# Altium project ZP2_SMT.PrjPcb
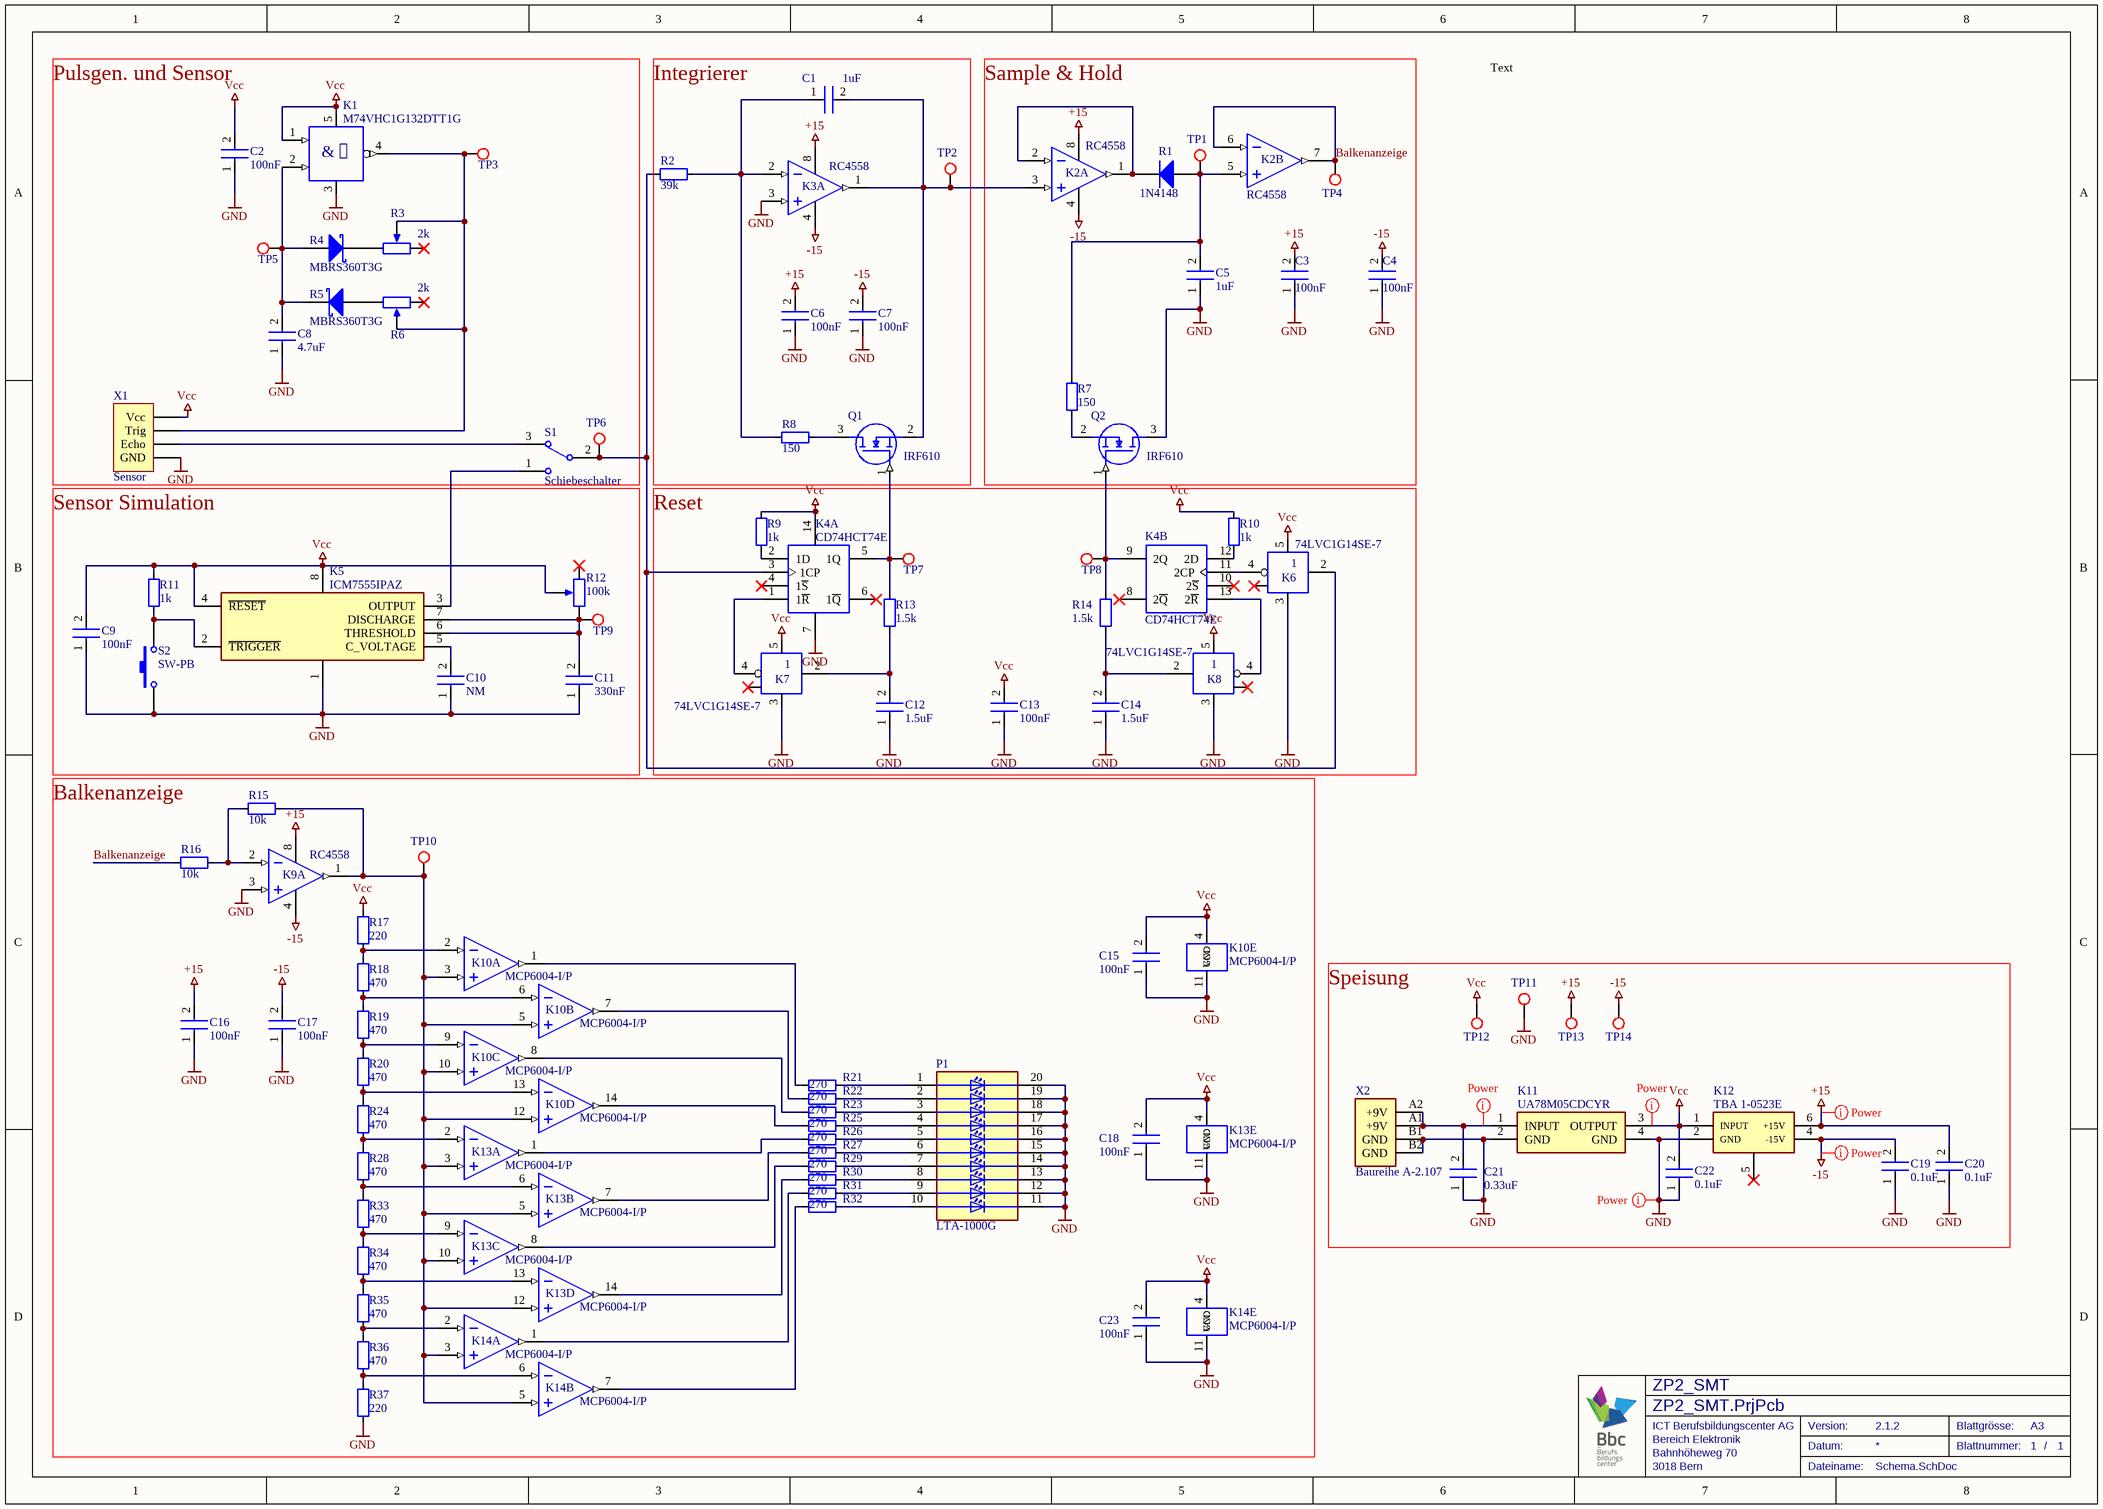
[diagram p0: Schema.SchDoc]
1 sheet, 95 parts. Net scope: global (net labels, ports and power ports of the same name join across sheets).
Board file: PCB.PcbDoc

## Sheet Schema.SchDoc: ZP2_SMT
size A3; Date: 18.08.2020; Author: bweina; CompanyName: ICT Bbc AG; DrawnBy: bweina; DocumentNumber: 1; Revision: 2.1.2; SheetNumber: 1; SheetTotal: 1

### Parts
C1  1uF  [okCAP CER 1206 H]
C2  100nF  [okCAP CER 1206 H]
C3  100nF  [okCAP CER 1206 H]
C4  100nF  [okCAP CER 1206 H]
C5  1uF  [okCAP CER 1206 H]
C6  100nF  [okCAP CER 1206 H]
C7  100nF  [okCAP CER 1206 H]
C8  4.7uF  [okCAP CER 1206 H]
C9  100nF  [okCAP CER 1206 H]
C10  NM  [okCAP CER 1206 H]
C11  330nF  [okCAP CER 1206 H]
C12  1.5uF  [okCAP CER 1206 H]
C13  100nF  [okCAP CER 1206 H]
C14  1.5uF  [okCAP CER 1206 H]
C15  100nF  [okCAP CER 1206 H]
C16  100nF  [okCAP CER 1206 H]
C17  100nF  [okCAP CER 1206 H]
C18  100nF  [okCAP CER 1206 H]
C19  0.1uF  [okCAP CER 1206 H]
C20  0.1uF  [okCAP CER 1206 H]
C21  0.33uF  [okCAP CER 1206 H]
C22  0.1uF  [okCAP CER 1206 H]
C23  100nF  [okCAP CER 1206 H]
K1  M74VHC1G132DTT1G  [okTSOP-5]
K2  RC4558  [okDIP8-300]  (parts A,B of 2)
K3  RC4558  [okDIP8-300]  (part A of 2)
K4  CD74HCT74E  [okDIP14-300]  (parts A,B of 2)
K5  ICM7555IPAZ  [okDIP8-300]
K6  74LVC1G14SE-7  [okSOT23-5]
K7  74LVC1G14SE-7  [okSOT23-5]
K8  74LVC1G14SE-7  [okSOT23-5]
K9  RC4558  [okDIP8-300]  (part A of 2)
K10  MCP6004-I/P  [okDIP14-300]  (parts A,B,C,D,E of 5)
K11  UA78M05CDCYR  [okSOT23-UA78M05]
K12  TBA 1-0523E  [okTBA 1-0523E]
K13  MCP6004-I/P  [okDIP14-300]  (parts A,B,C,D,E of 5)
K14  MCP6004-I/P  [okDIP14-300]  (parts A,B,E of 5)
P1  LTA-1000G  [okDIP20]
Q1  IRF610  [okTO-220-1]
Q2  IRF610  [okTO-220-1]
R1  1N4148  [okDiode 10mm]
R2  value 39k  [okRES 10mm]  (hidden comment: Resistor)
R3  value 2k  [ok3362P]  (hidden comment: RPot)
R4  MBRS360T3G  [okDiode DO-214AA SMB H]
R5  MBRS360T3G  [okDiode DO-214AA SMB H]
R6  value 2k  [ok3362P]  (hidden comment: RPot)
R7  value 150  [okRES 10mm]  (hidden comment: Resistor)
R8  value 150  [okRES 10mm]  (hidden comment: Resistor)
R9  value 1k  [okRES 10mm]  (hidden comment: Resistor)
R10  value 1k  [okRES 10mm]  (hidden comment: Resistor)
R11  value 1k  [okRES 10mm]  (hidden comment: Resistor)
R12  value 100k  [ok3386F]  (hidden comment: RPot)
R13  value 1.5k  [okRES 10mm]  (hidden comment: Resistor)
R14  value 1.5k  [okRES 10mm]  (hidden comment: Resistor)
R15  value 10k  [okRES 10mm]  (hidden comment: Resistor)
R16  value 10k  [okRES 10mm]  (hidden comment: Resistor)
R17  value 220  [okRES 10mm]  (hidden comment: Resistor)
R18  value 470  [okRES 10mm]  (hidden comment: Resistor)
R19  value 470  [okRES 10mm]  (hidden comment: Resistor)
R20  value 470  [okRES 10mm]  (hidden comment: Resistor)
R21  value 270  [okRES 10mm]  (hidden comment: Resistor)
R22  value 270  [okRES 10mm]  (hidden comment: Resistor)
R23  value 270  [okRES 10mm]  (hidden comment: Resistor)
R24  value 470  [okRES 10mm]  (hidden comment: Resistor)
R25  value 270  [okRES 10mm]  (hidden comment: Resistor)
R26  value 270  [okRES 10mm]  (hidden comment: Resistor)
R27  value 270  [okRES 10mm]  (hidden comment: Resistor)
R28  value 470  [okRES 10mm]  (hidden comment: Resistor)
R29  value 270  [okRES 10mm]  (hidden comment: Resistor)
R30  value 270  [okRES 10mm]  (hidden comment: Resistor)
R31  value 270  [okRES 10mm]  (hidden comment: Resistor)
R32  value 270  [okRES 10mm]  (hidden comment: Resistor)
R33  value 470  [okRES 10mm]  (hidden comment: Resistor)
R34  value 470  [okRES 10mm]  (hidden comment: Resistor)
R35  value 470  [okRES 10mm]  (hidden comment: Resistor)
R36  value 470  [okRES 10mm]  (hidden comment: Resistor)
R37  value 220  [okRES 10mm]  (hidden comment: Resistor)
S1  Schiebeschalter  [okSCHIEBESCHALTER]
S2  SW-PB  [okdrucktaster]
TP1  Lötstützpunkt  [okLötstützpunkt]  (value not drawn)
TP2  Lötstützpunkt  [okLötstützpunkt]  (value not drawn)
TP3  Lötstützpunkt  [okLötstützpunkt]  (value not drawn)
TP4  Lötstützpunkt  [okLötstützpunkt]  (value not drawn)
TP5  Lötstützpunkt  [okLötstützpunkt]  (value not drawn)
TP6  Lötstützpunkt  [okLötstützpunkt]  (value not drawn)
TP7  Lötstützpunkt  [okLötstützpunkt]  (value not drawn)
TP8  Lötstützpunkt  [okLötstützpunkt]  (value not drawn)
TP9  Lötstützpunkt  [okLötstützpunkt]  (value not drawn)
TP10  Lötstützpunkt  [okLötstützpunkt]  (value not drawn)
TP11  Lötstützpunkt  [okLötstützpunkt]  (value not drawn)
TP12  Lötstützpunkt  [okLötstützpunkt]  (value not drawn)
TP13  Lötstützpunkt  [okLötstützpunkt]  (value not drawn)
TP14  Lötstützpunkt  [okLötstützpunkt]  (value not drawn)
X1  Sensor  [okHeader Female 4pin]
X2  Baureihe A-2.107  [ok24.243.X]

### Nets
+15: C3.2 C6.2 C16.2 C20.2 K2.8(V+) K3.8(V+) K9.8(V+) K12.6(+15V) TP13.1
-15: C4.2 C7.2 C17.2 C19.2 K2.4(V-) K3.4(V-) K9.4(V-) K12.4(-15V) TP14.1
GND: C2.1 C3.1 C4.1 C5.1 C6.1 C7.1 C8.1 C9.1 C10.1 C11.1 C12.1 C13.1 C14.1 C15.1 C16.1 C17.1 C18.1 C19.1 C20.1 C21.1 C22.1 C23.1 K1.3(GND) K3.3(IN1+) K4.7(GND) K5.1(GND) K6.3(GND) K7.3(GND) K8.3(GND) K9.3(IN1+) K10.11(GND) K11.2(GND) K11.4(GND) K12.2(GND) K13.11(GND) K14.11(GND) P1.11(CATHODE_K) P1.12(CATHODE_J) P1.13(CATHODE_H) P1.14(CATHODE_G) P1.15(CATHODE_F) P1.16(CATHODE_E) P1.17(CATHODE_D) P1.18(CATHODE_C) P1.19(CATHODE_B) P1.20(CATHODE_A) Q2.3(D) R37.1 S2.4 TP11.1 X1.4(GND) X2.B1(GND) X2.B2(GND)
Vcc: C2.2 C9.2 C13.2 C15.2 C18.2 C22.2 C23.2 K1.1(A) K1.5(VCC) K4.14(VCC) K5.4(~{RESET}) K5.8(VDD) K6.5(Vcc) K7.5(Vcc) K8.5(Vcc) K10.4(VCC) K11.3(OUTPUT) K12.1(INPUT) K13.4(VCC) K14.4(VCC) R9.2 R10.2 R11.2 R12.2(TAP) R17.2 TP12.1 X1.1(Vcc)
Balkenanzeige: K2.6(IN2-) K2.7(OUT2) R16.1 TP4.1
NetC1_1: C1.1 K3.2(IN1-) R2.2 R8.1
NetC1_2: C1.2 K2.3(IN1+) K3.1(OUT1) Q1.2(S) TP2.1
NetC5_2: C5.2 K2.5(IN2+) R1.A(Anode) R7.2 TP1.1
NetC8_2: C8.2 K1.2(B) R4.3(A) R5.1(K) TP5.1
NetC10_2: C10.2 K5.5(C_VOLTAGE)
NetC11_2: C11.2 K5.6(THRESHOLD) K5.7(DISCHARGE) R12.1(BOT) TP9.1
NetC12_2: C12.2 K7.2(A) R13.1
NetC14_2: C14.2 K8.2(A) R14.2
NetC21_2: C21.2 K11.1(INPUT) X2.A1(+9V) X2.A2(+9V)
NetK1_4: K1.4(~{Y}) R3.2(TAP) R6.2(TAP) TP3.1 X1.2(Trig)
NetK2_1: K2.1(OUT1) K2.2(IN1-) R1.C(Cathode)
NetK4_1: K4.1(1~{R}) K7.4(Y)
NetK4_2: K4.2(1D) R9.1
NetK4_3: K4.3(1CP) K6.2(A) R2.1 S1.2 TP6.1
NetK4_5: K4.5(1Q) Q1.1(G) R13.2 TP7.1
NetK4_9: K4.9(2Q) Q2.1(G) R14.1 TP8.1
NetK4_11: K4.11(2CP) K6.4(Y)
NetK4_12: K4.12(2D) R10.1
NetK4_13: K4.13(2~{R}) K8.4(Y)
NetK5_2: K5.2(~{TRIGGER}) R11.1 S2.1
NetK5_3: K5.3(OUTPUT) S1.1
NetK9_1: K9.1(OUT1) K10.3(VINA+) K10.5(VINB+) K10.10(VINC+) K10.12(VIND+) K13.3(VINA+) K13.5(VINB+) K13.10(VINC+) K13.12(VIND+) K14.3(VINA+) K14.5(VINB+) R15.2 TP10.1
NetK9_2: K9.2(IN1-) R15.1 R16.2
NetK10_1: K10.1(VOUTA) R21.1
NetK10_2: K10.2(VINA-) R17.1 R18.2
NetK10_6: K10.6(VINB-) R18.1 R19.2
NetK10_7: K10.7(VOUTB) R22.1
NetK10_8: K10.8(VOUTC) R23.1
NetK10_9: K10.9(VINC-) R19.1 R20.2
NetK10_13: K10.13(VIND-) R20.1 R24.2
NetK10_14: K10.14(VOUTD) R25.1
NetK13_1: K13.1(VOUTA) R26.1
NetK13_2: K13.2(VINA-) R24.1 R28.2
NetK13_6: K13.6(VINB-) R28.1 R33.2
NetK13_7: K13.7(VOUTB) R27.1
NetK13_8: K13.8(VOUTC) R29.1
NetK13_9: K13.9(VINC-) R33.1 R34.2
NetK13_13: K13.13(VIND-) R34.1 R35.2
NetK13_14: K13.14(VOUTD) R30.1
NetK14_1: K14.1(VOUTA) R31.1
NetK14_2: K14.2(VINA-) R35.1 R36.2
NetK14_6: K14.6(VINB-) R36.1 R37.2
NetK14_7: K14.7(VOUTB) R32.1
NetP1_1: P1.1(ANODE_A) R21.2
NetP1_2: P1.2(ANODE_B) R22.2
NetP1_3: P1.3(ANODE_C) R23.2
NetP1_4: P1.4(ANODE_D) R25.2
NetP1_5: P1.5(ANODE_E) R26.2
NetP1_6: P1.6(ANODE_F) R27.2
NetP1_7: P1.7(ANODE_G) R29.2
NetP1_8: P1.8(ANODE_H) R30.2
NetP1_9: P1.9(ANODE_J) R31.2
NetP1_10: P1.10(ANODE__K) R32.2
NetQ1_3: Q1.3(D) R8.2
NetQ2_2: Q2.2(S) R7.1
NetR3_1: R3.1(BOT) R4.1(K)
NetR5_3: R5.3(A) R6.1(BOT)
NetS1_3: S1.3 X1.3(Echo)

Not connected (* = marked no-connect by the designer): K4 4(1~{S})* 6(1~{Q})* 8(2~{Q})* 10(2~{S})*; K6 1(NC)*; K7 1(NC)*; K8 1(NC)*; K12 5(NC)*; R3 3(TOP)*; R6 3(TOP)*; R12 3(TOP)*

### Layout directives
net class Power: +15, -15, GND, NetC21_2, Vcc

### Notes on the sheet
- Pulsgen. und Sensor
- Integrierer
- Sample & Hold
- Sensor Simulation
- Reset
- Text
- Speisung
- Balkenanzeige
- Bahnhöheweg 70
- ICT Berufsbildungscenter AG
- Bereich Elektronik
- Datum:
- Version:
- Blattgrösse:
- Blattnummer:
- A3
- /
- 3018 Bern
- Dateiname:
- (in symbol M74VHC1G132DFT1G) &; ⎎

### Library data of the parts
C1-C23 = CAP0805: Capacitor; Manufacturer_Name: AVX; Manufacturer_Part_Number: 08055A101JAT2A; Datasheet Link: https://componentsearchengine.com/Datasheets/1/06031A100FAT2A.pdf; Height: 0.94mm; Arrow Part Number: 08055A101JAT2A; Arrow Price/Stock: https://www.arrow.com/en/products/08055a101jat2a/avx; Mouser Part Number: 581-08055A101J; Mouser Price/Stock: https://www.mouser.co.uk/ProductDetail/AVX/08055A101JAT2A?qs=o9qE778H9QGBR%2FfSpI%2FCIw%3D%3D
K1 = M74VHC1G132DFT1G: Integrated Circuit; Manufacturer_Name: ON Semiconductor; Datasheet Link: http://www.onsemi.com/pub/Collateral/MC74VHC1G132-D.PDF; Height: 1.1mm; Manufacturer_Part_Number: M74VHC1G132DFT1G; Arrow Part Number: M74VHC1G132DFT1G; Mouser Part Number: 863-M74VHC1G132DFT1G; Mouser Price/Stock: https://www.mouser.co.uk/ProductDetail/ON-Semiconductor/M74VHC1G132DFT1G?qs=3JMERSakeboO%2F%2FN0rc0eEw%3D%3D
K2 K3 K9 = RC4558: Dual OPAMP / Dual Supply 5-15V; Supplier 1: Mouser; Supplier Part Number 1: 595-RC4558P
K4 = CD74HCT74E: Integrated Circuit; Manufacturer_Name: Texas Instruments; Datasheet Link: http://www.ti.com/lit/gpn/cd74hct74; Height: 5.08mm; Manufacturer_Part_Number: CD74HCT74E; Arrow Part Number: CD74HCT74E; Arrow Price/Stock: https://www.arrow.com/en/products/cd74hct74e/texas-instruments; Mouser Part Number: 595-CD74HCT74E; Mouser Price/Stock: https://www.mouser.com/Search/Refine.aspx?Keyword=595-CD74HCT74E
K5 = ICM7555IPAZ: Integrated Circuit; Manufacturer_Name: Intersil; Manufacturer_Part_Number: ICM7555CBAZ; Datasheet Link: http://componentsearchengine.com/Datasheets/3/ICM7555CBAZ.pdf; Height: 1.75mm; Arrow Part Number: ICM7555CBAZ; Arrow Price/Stock: https://www.arrow.com/en/products/icm7555cbaz/intersil; Mouser Part Number: 968-ICM7555CBAZ; Mouser Price/Stock: http://www.mouser.com/Search/ProductDetail.aspx?qs=9fLuogzTs8L0U86ICDKxeg%3d%3d
K6-K8 = 74LVC1G14SE-7: Integrated Circuit; Manufacturer_Name: Diodes Inc.; Manufacturer_Part_Number: 74AHC1G04SE-7; Datasheet Link: https://componentsearchengine.com/Datasheets/2/74AHC1G04SE-7.pdf; Height: 1.1mm; Arrow Part Number: 74AHC1G04SE-7; Arrow Price/Stock: https://www.arrow.com/en/products/74ahc1g04se-7/diodes-incorporated; Mouser Part Number: 621-74AHC1G04SE-7; Mouser Price/Stock: https://www.mouser.com/Search/Refine.aspx?Keyword=621-74AHC1G04SE-7
K10 K13 K14 = MCP6004-I/P: Quad OPAMP / Single Supply 1.8-6.3V / Rail to Rail; Supplier 1: Mouser; Supplier Part Number 1: 579-MCP6004-I/P
K11 = UA78M05CDCYR: Integrated Circuit; Manufacturer_Name: Texas Instruments; Datasheet Link: http://www.ti.com/lit/gpn/ua78m; Height: 1.8mm; Manufacturer_Part_Number: UA78M05CDCYR; Arrow Part Number: UA78M05CDCYR; Arrow Price/Stock: https://www.arrow.com/en/products/ua78m05cdcyr/texas-instruments; Mouser Part Number: 595-UA78M05CDCYR; Mouser Price/Stock: https://www.mouser.co.uk/ProductDetail/Texas-Instruments/UA78M05CDCYR?qs=Tv815z3GeNQBLgK%2F7rn3pg%3D%3D
K12 = TBA 1-0523E: DC/DC
P1 = LTA-1000G: Display; Manufacturer_Name: Lite-On; Datasheet Link: https://optoelectronics.liteon.com/upload/download/DS-30-92-0809/A1000G.pdf; Height: 8.25mm; Manufacturer_Part_Number: LTA-1000G; Arrow Part Number: LTA-1000G; Arrow Price/Stock: https://www.arrow.com/en/products/lta-1000g/lite-on-technology; Mouser Part Number: 859-LTA-1000G; Mouser Price/Stock: https://www.mouser.co.uk/ProductDetail/Lite-On/LTA-1000G?qs=%2FTKcI5XXRKq0QINzVmwJHg%3D%3D
Q1 Q2 = IRF610: MOSFET (N-Channel); Reset; Manufacturer_Name: Nexperia; Manufacturer_Part_Number: 2N7002; Datasheet Link: http://docs-emea.rs-online.com/webdocs/1385/0900766b813856ab.pdf; Height: 1.1mm; Arrow Part Number: 2N7002; Mouser Part Number: N/A; Mouser Price/Stock: https://www.mouser.com/Search/Refine.aspx?Keyword=N%2FA
R1 = Diode: LatestRevisionDate: 03.04.2019; Publisher: ICT Berufsbildungscenter AG
R3 R6 R12 = RPot: Potentiometer; Sim Note: Enter the Resistance value and the set point into parameter fields.; Set Position: 0.5; Published: 8-Jun-2000; LatestRevisionDate: 17-Jul-2002; LatestRevisionNote: Re-released for DXP Platform.; PackageReference: VR5; Publisher: Altium Limited; PackageDescription: Variable Resistor, Thru-Hole; 3 Leads
R4 R5 = Schottky Diode: Note: Terminal 2 is the TAB and is electrically connected to the cathode; LatestRevisionDate: 17-Jul-2002; Publisher: Altium Limited; Published: 8-Jun-2000; LatestRevisionNote: Re-released for DXP Platform.; DatasheetVersion: PD-2.057B; PackageVersion: Feb-1998; PackageReference: TO-220AC; PackageDescription: TO, Thru-Hole, Vertical, Heatsink Mounted; 3 In-Line Leads (1 Absent); Pitch 2.54 mm; ComponentLink1Description: Manufacturer Link; ComponentLink1URL: http://www.irf.com/; ComponentLink2Description: Datasheet; ComponentLink2URL: http://www.irf.com/product-info/datasheets/data/10tq.pdf
S1 = Schiebeschalter: Switch, THT; Published: 24-Mar-1999; LatestRevisionDate: 17-Dec-2003; LatestRevisionNote: Schematic revised, PCB Footprint replaced.; DatasheetVersion: 05-Dec-2000; PackageReference: TL36WW15050; Publisher: Altium Limited; PackageDescription: Switch; 4 Leads; ComponentLink1Description: Manufacturer Link; ComponentLink1URL: http://www.apem.com
S2 = Drucktaster: Switch, SMD; Published: 24-Mar-1999; LatestRevisionDate: 17-Jul-2002; LatestRevisionNote: Re-released for DXP Platform.; PackageReference: SPST-2; Publisher: Altium Limited; PackageDescription: Switch; 2 Leads
TP1-TP14 = Testpunkt
X1 = Header 4: Header, 4-Pin; LatestRevisionDate: 17-Jul-2002; LatestRevisionNote: Re-released for DXP Platform.; Publisher: Altium Limited
X2 = Bananenstecker: Laborgerätanschluss, 4mm; LatestRevisionDate: 17-Jul-2002; LatestRevisionNote: Re-released for DXP Platform.; Publisher: Altium Limited
R2 R7-R11 R13-R37 = Resistor: LatestRevisionDate: 02.04.2019; Publisher: ICT Berufsbildungscenter AG